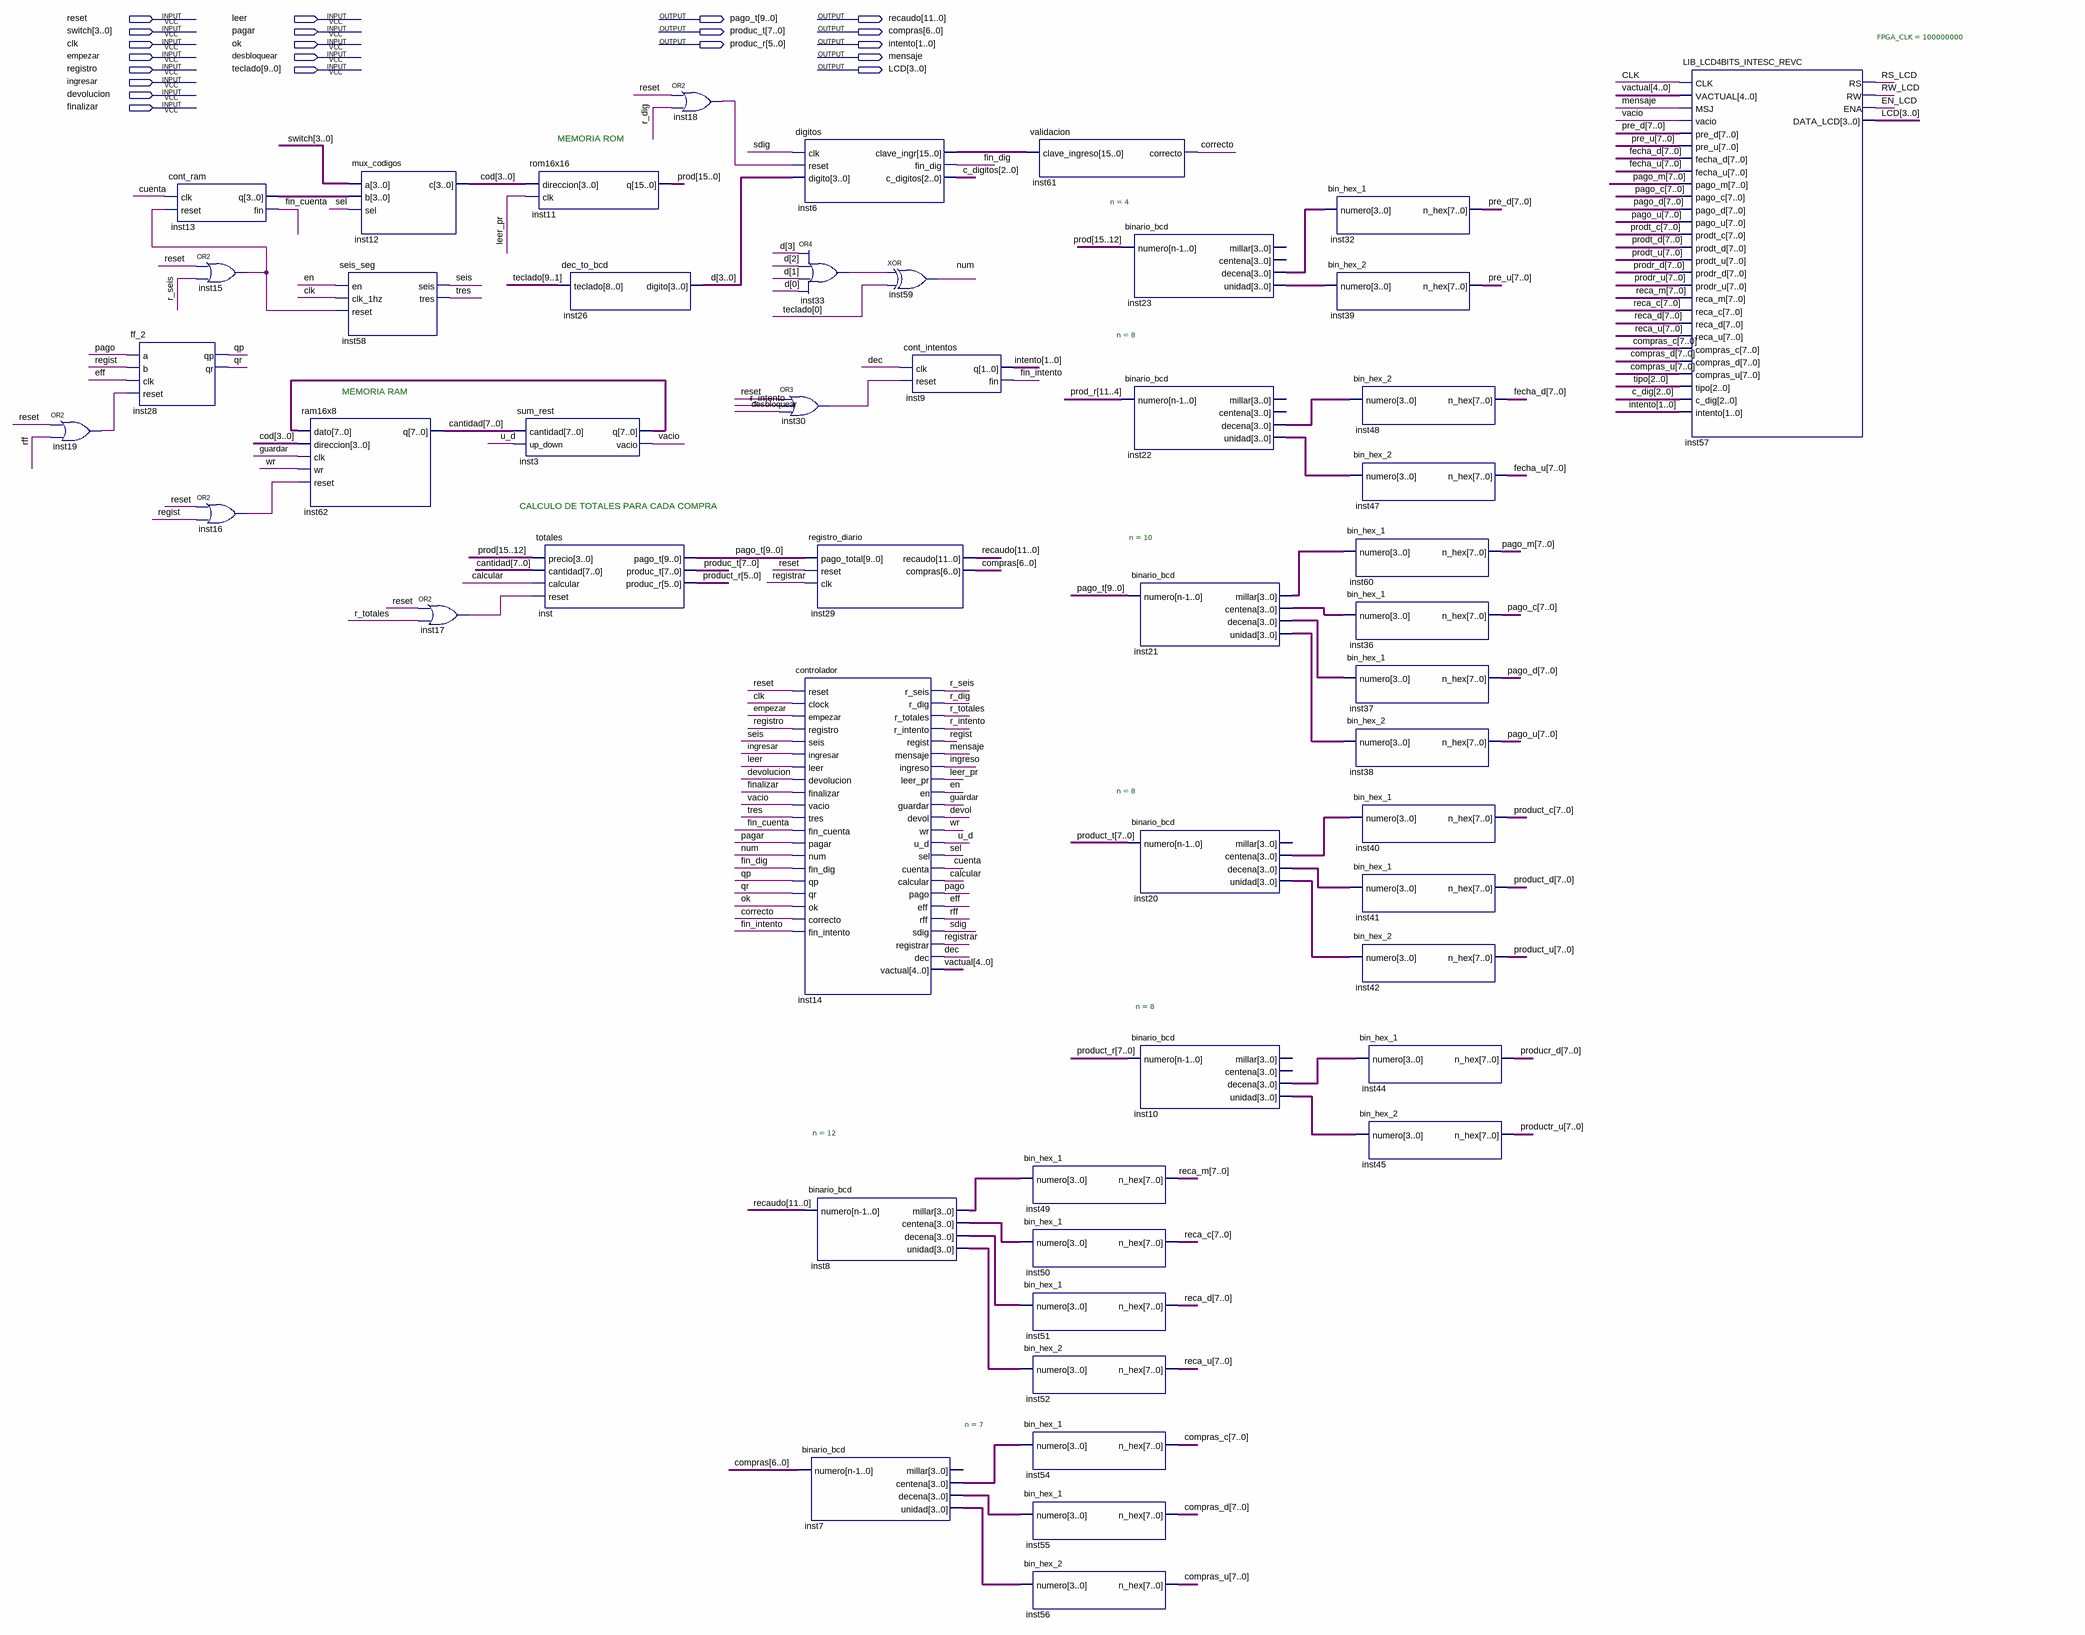
[diagram p0: schematic sheet]
// Quartus schematic CARRO_DE_COMPRAS.bdf as structural Verilog: 50 symbols, 21 pins
module CARRO_DE_COMPRAS (
  input  reset,
  input  leer,
  input  [3:0] switch,
  input  pagar,
  input  clk,
  input  ok,
  input  empezar,
  input  desbloquear,
  input  registro,
  input  [9:0] teclado,
  input  ingresar,
  input  devolucion,
  input  finalizar,
  output [9:0] pago_t,
  output [11:0] recaudo,
  output [7:0] produc_t,
  output [6:0] compras,
  output [5:0] produc_r,
  output [1:0] intento,
  output mensaje,
  output [3:0] LCD
);

  wire calcular, correcto, cuenta, dec, devol, eff, en, EN_LCD, fin_cuenta, fin_dig, fin_intento, guardar,
       ingreso, inst15_out, inst16_out, inst17_out, inst18_out, inst19_out, inst30_out, inst33_out, leer_pr,
       num, pago, qp, qr, r_dig, r_intento, r_seis, r_totales, regist, registrar, rff, RS_LCD, RW_LCD, sdig,
       seis, sel, tres, u_d, vacio, wr;
  wire [2:0] c_dig, c_digitos, tipo;
  wire [3:0] cod, d, inst7_centena, inst7_decena, inst7_unidad, inst8_centena, inst8_decena, inst8_millar,
       inst8_unidad, inst10_decena, inst10_unidad, inst13_q, inst20_centena, inst20_decena, inst20_unidad,
       inst21_centena, inst21_decena, inst21_millar, inst21_unidad, inst22_decena, inst22_unidad,
       inst23_decena, inst23_unidad;
  wire [4:0] vactual;
  wire [7:0] cantidad, compras_c, compras_d, compras_u, fecha_d, fecha_u, inst3_q, pago_c, pago_d, pago_m,
       pago_u, pre_d, pre_u, prodr_d, prodr_u, prodt_c, prodt_d, prodt_u, producr_d, product_c, product_d,
       product_r, product_t, product_u, productr_u, reca_c, reca_d, reca_m, reca_u;
  wire [11:4] prod_r;
  wire [15:0] inst6_clave_ingr, prod;

  or inst19 (inst19_out, reset, rff);
  ff_2 inst28 (.a(pago), .b(regist), .clk(eff), .reset(inst19_out), .qp(qp), .qr(qr));
  cont_ram inst13 (.clk(cuenta), .reset(inst15_out), .q(inst13_q), .fin(fin_cuenta));
  or inst15 (inst15_out, reset, r_seis);
  or inst16 (inst16_out, reset, regist);
  seis_seg inst58 (.en(en), .clk_1hz(clk), .reset(inst15_out), .seis(seis), .tres(tres));
  ram16x8 inst62 (.dato(inst3_q), .direccion(cod), .clk(guardar), .wr(wr), .reset(inst16_out), .q(cantidad));
  mux_codigos inst12 (.a(switch), .b(inst13_q), .sel(sel), .c(cod));
  or inst17 (inst17_out, reset, r_totales);
  rom16x16 inst11 (.direccion(cod), .clk(leer_pr), .q(prod));
  sum_rest inst3 (.cantidad(cantidad), .up_down(u_d), .q(inst3_q), .vacio(vacio));
  totales inst (
    .precio(prod[15:12]), .cantidad(cantidad), .calcular(calcular), .reset(inst17_out), .pago_t(pago_t),
    .produc_t(produc_t), .produc_r(product_r[5:0]));
  dec_to_bcd inst26 (.teclado(teclado[9:1]), .digito(d));
  or inst18 (inst18_out, reset, r_dig);
  digitos inst6 (
    .clk(sdig), .reset(inst18_out), .digito(d), .clave_ingr(inst6_clave_ingr), .fin_dig(fin_dig),
    .c_digitos(c_digitos));
  or inst30 (inst30_out, reset, r_intento, desbloquear);
  controlador inst14 (
    .reset(reset), .clock(clk), .empezar(empezar), .registro(registro), .seis(seis), .ingresar(ingresar),
    .leer(leer), .devolucion(devolucion), .finalizar(finalizar), .vacio(vacio), .tres(tres),
    .fin_cuenta(fin_cuenta), .pagar(pagar), .num(num), .fin_dig(fin_dig), .qp(qp), .qr(qr), .ok(ok),
    .correcto(correcto), .fin_intento(fin_intento), .r_seis(r_seis), .r_dig(r_dig), .r_totales(r_totales),
    .r_intento(r_intento), .regist(regist), .mensaje(mensaje), .ingreso(ingreso), .leer_pr(leer_pr), .en(en),
    .guardar(guardar), .devol(devol), .wr(wr), .u_d(u_d), .sel(sel), .cuenta(cuenta), .calcular(calcular),
    .pago(pago), .eff(eff), .rff(rff), .sdig(sdig), .registrar(registrar), .dec(dec), .vactual(vactual));
  or inst33 (inst33_out, d[3], d[2], d[1], d[0]);
  registro_diario inst29 (.pago_total(pago_t), .reset(reset), .clk(registrar), .recaudo(recaudo), .compras(compras));
  binario_bcd #(.n(12)) inst8 (
    .numero(recaudo), .millar(inst8_millar), .centena(inst8_centena), .decena(inst8_decena),
    .unidad(inst8_unidad));
  binario_bcd #(.n(7)) inst7 (
    .numero(compras), .centena(inst7_centena), .decena(inst7_decena), .unidad(inst7_unidad));  // open: millar
  xor inst59 (num, inst33_out, teclado[0]);
  cont_intentos inst9 (.clk(dec), .reset(inst30_out), .q(intento), .fin(fin_intento));
  validacion inst61 (.clave_ingreso(inst6_clave_ingr), .correcto(correcto));
  bin_hex_1 inst49 (.numero(inst8_millar), .n_hex(reca_m));
  bin_hex_1 inst50 (.numero(inst8_centena), .n_hex(reca_c));
  bin_hex_1 inst51 (.numero(inst8_decena), .n_hex(reca_d));
  bin_hex_2 inst52 (.numero(inst8_unidad), .n_hex(reca_u));
  bin_hex_1 inst54 (.numero(inst7_centena), .n_hex(compras_c));
  bin_hex_1 inst55 (.numero(inst7_decena), .n_hex(compras_d));
  bin_hex_2 inst56 (.numero(inst7_unidad), .n_hex(compras_u));
  binario_bcd #(.n(4)) inst23 (
    .numero(prod[15:12]), .decena(inst23_decena), .unidad(inst23_unidad));  // open: millar, centena
  binario_bcd #(.n(8)) inst22 (
    .numero(prod_r), .decena(inst22_decena), .unidad(inst22_unidad));  // open: millar, centena
  binario_bcd #(.n(10)) inst21 (
    .numero(pago_t), .millar(inst21_millar), .centena(inst21_centena), .decena(inst21_decena),
    .unidad(inst21_unidad));
  binario_bcd #(.n(8)) inst20 (
    .numero(product_t), .centena(inst20_centena), .decena(inst20_decena), .unidad(inst20_unidad));  // open: millar
  binario_bcd #(.n(8)) inst10 (
    .numero(product_r), .decena(inst10_decena), .unidad(inst10_unidad));  // open: millar, centena
  bin_hex_1 inst32 (.numero(inst23_decena), .n_hex(pre_d));
  bin_hex_2 inst39 (.numero(inst23_unidad), .n_hex(pre_u));
  bin_hex_2 inst48 (.numero(inst22_decena), .n_hex(fecha_d));
  bin_hex_2 inst47 (.numero(inst22_unidad), .n_hex(fecha_u));
  bin_hex_1 inst60 (.numero(inst21_millar), .n_hex(pago_m));
  bin_hex_1 inst36 (.numero(inst21_centena), .n_hex(pago_c));
  bin_hex_1 inst37 (.numero(inst21_decena), .n_hex(pago_d));
  bin_hex_2 inst38 (.numero(inst21_unidad), .n_hex(pago_u));
  bin_hex_1 inst40 (.numero(inst20_centena), .n_hex(product_c));
  bin_hex_1 inst41 (.numero(inst20_decena), .n_hex(product_d));
  bin_hex_2 inst42 (.numero(inst20_unidad), .n_hex(product_u));
  bin_hex_1 inst44 (.numero(inst10_decena), .n_hex(producr_d));
  bin_hex_2 inst45 (.numero(inst10_unidad), .n_hex(productr_u));
  LIB_LCD4BITS_INTESC_REVC #(.FPGA_CLK(100000000)) inst57 (
    .CLK(clk), .VACTUAL(vactual), .MSJ(mensaje), .vacio(vacio), .pre_d(pre_d), .pre_u(pre_u),
    .fecha_d(fecha_d), .fecha_u(fecha_u), .pago_m(pago_m), .pago_c(pago_c), .pago_d(pago_d), .pago_u(pago_u),
    .prodt_c(prodt_c), .prodt_d(prodt_d), .prodt_u(prodt_u), .prodr_d(prodr_d), .prodr_u(prodr_u),
    .reca_m(reca_m), .reca_c(reca_c), .reca_d(reca_d), .reca_u(reca_u), .compras_c(compras_c),
    .compras_d(compras_d), .compras_u(compras_u), .tipo(tipo), .c_dig(c_dig), .intento(intento), .RS(RS_LCD),
    .RW(RW_LCD), .ENA(EN_LCD), .DATA_LCD(LCD));

  // Notes on the sheet:
  //   MEMORIA ROM
  //   MEMORIA RAM
  //   CALCULO DE TOTALES PARA CADA COMPRA
endmodule
